# EAGLE board xio4_mez (EAGLE 9.4.2), part 1 of 2
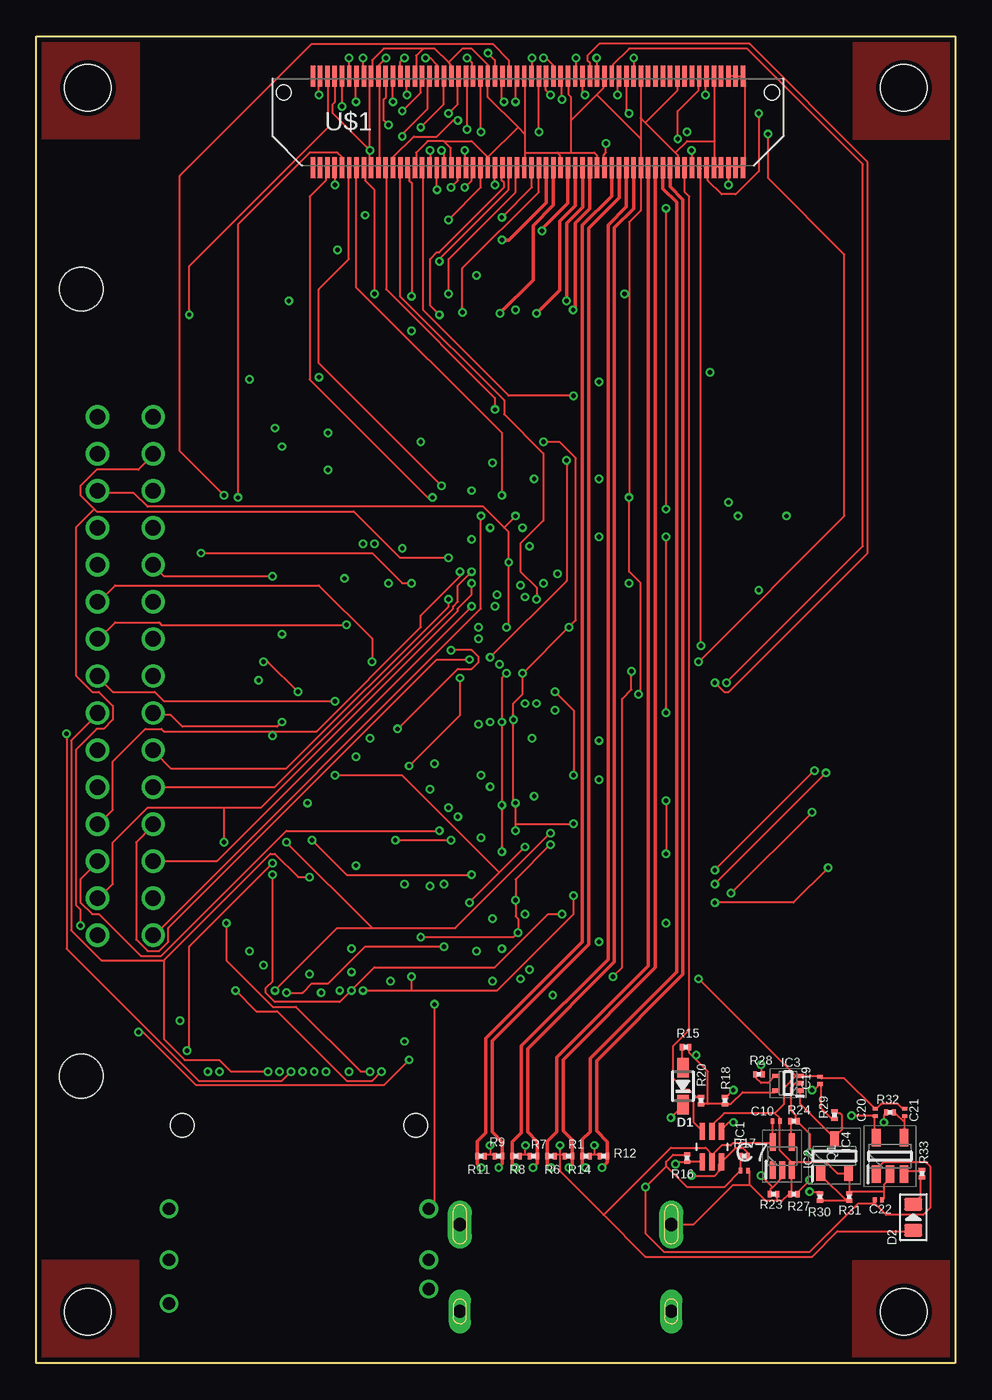
[diagram p7: board, top side]
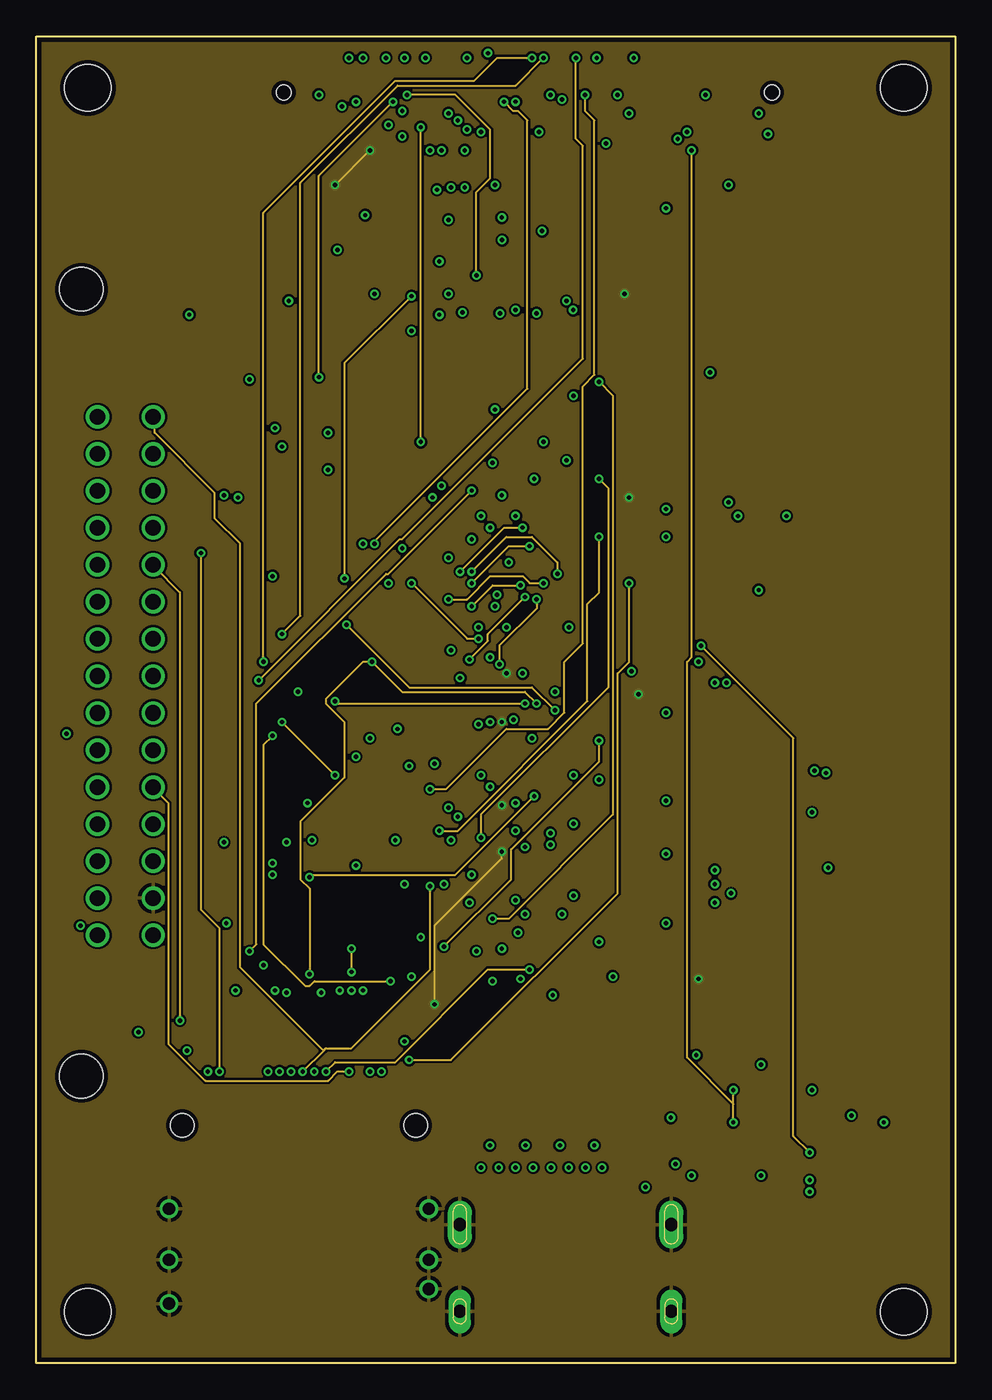
[diagram p8: board, inner layer Route2]
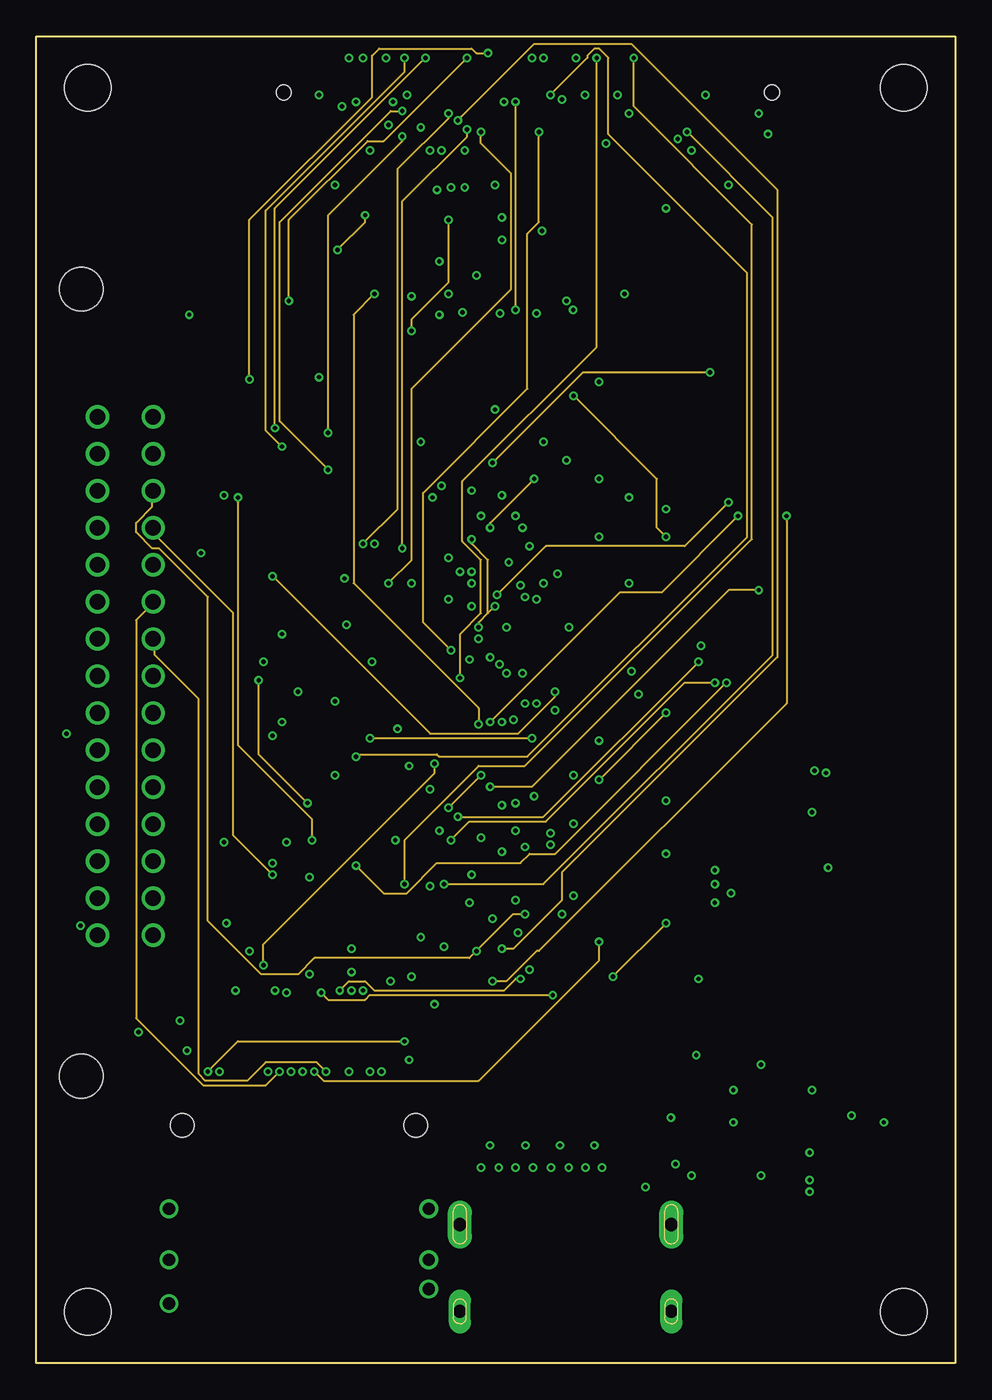
[diagram p9: board, inner layer Route15]
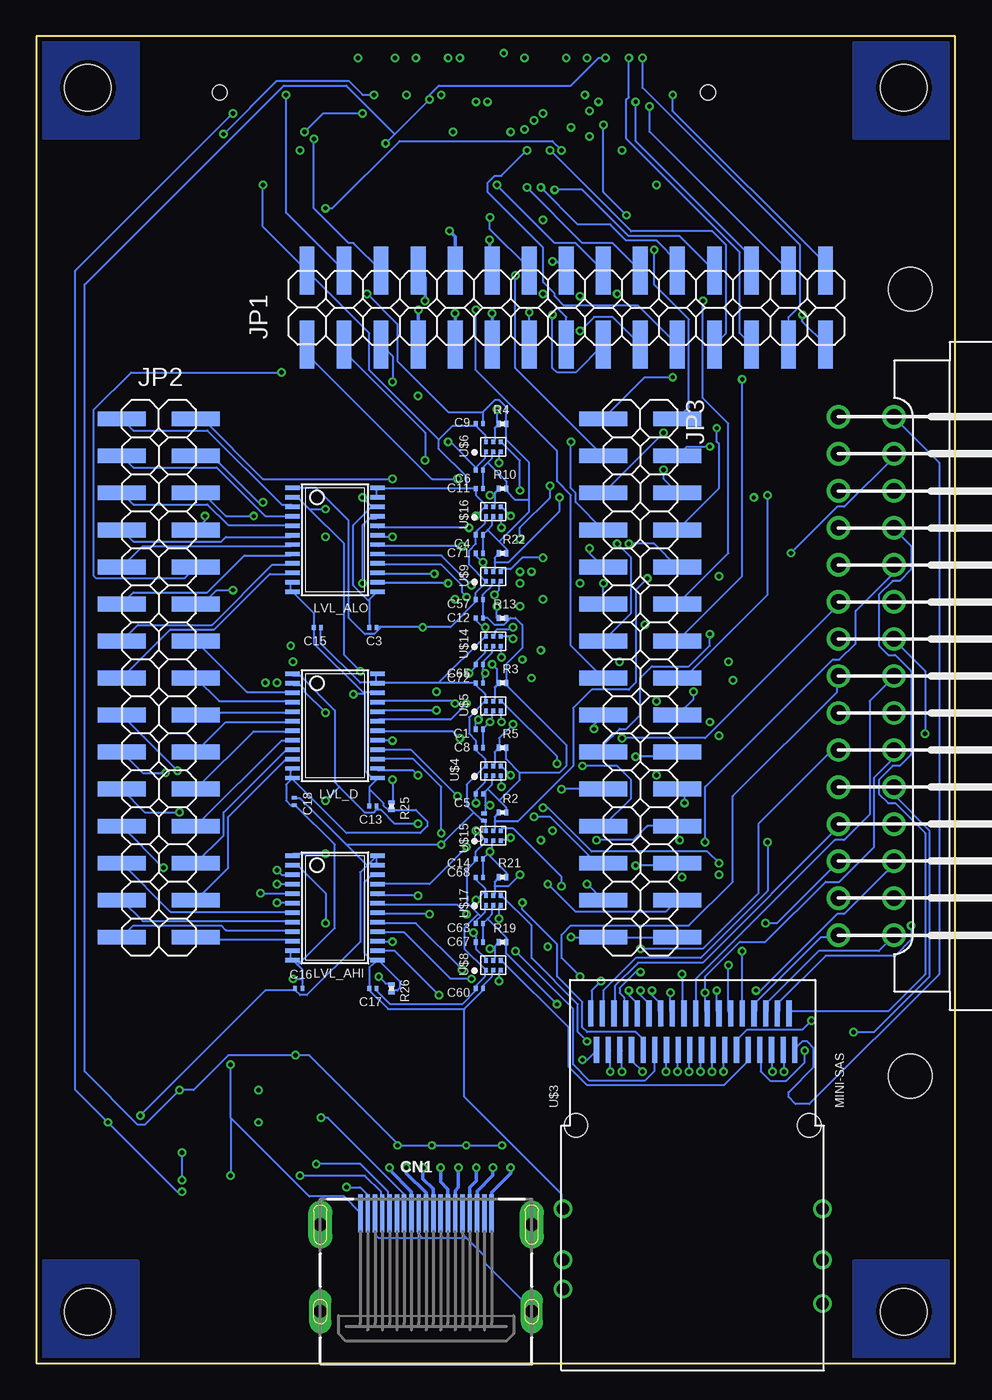
[diagram p10: board, bottom side, seen from below]

Size 63 x 91 mm. Coordinates in mm from the lower left corner, seen from the top.
Outline: 0,91 63,91 63,0 0,0 0,91
Copper layers (1+2*15+16): Top 0.035mm / dielectric 0.2mm / Route2 0.017mm / dielectric 1.2mm / Route15 0.017mm / dielectric 0.2mm / Bottom 0.035mm
Design rules "seed-4layer-6.6": minimum track width 6mil, minimum drill 0.3mm, track to track 6mil, track to pad 6mil, pad to pad 6mil, via to via 6mil, smd to smd 0mil, copper to edge 12mil, drill to drill 12mil, minimum pad ring 6mil, minimum via ring 5.5mil, stop-mask expansion 4mil, vias tented up to drill 25mil, thermal gap 10mil
Net classes: 1 Power: width 0.305 mm, drill 0.203 mm; 2 Slot-power: width 0.508 mm; 3 tx100: width 0.229 mm, clearance 0.203 mm; 4 usb90: width 0.254 mm, clearance 0.178 mm; 5 cclk50: width 0.203 mm; 6 3v3: width 0.254 mm; 7 vccint_aux: width 0.305 mm; 14 qspi: width 0.203 mm
Holes 3 mm at 3.08,19.68 3.08,73.66
Holes 3.2 mm at 3.52,3.52 3.52,87.48 59.48,87.48 59.48,3.52

## Footprints (pad centres in the part's own frame; a part is rotated, then mirrored left to right if it is on the bottom)
C0201 = smd 0.25 x 0.35: 1 -0.25,0; 2 0.25,0
A8_CART = drill 1.067: P1 -17.78,6.35; P2 -15.24,6.35; P3 -12.7,6.35; P4 -10.16,6.35; P5 -7.62,6.35; P6 -5.08,6.35; P7 -2.54,6.35; P8 0,6.35; P9 2.54,6.35; P10 5.08,6.35; P11 7.62,6.35; P12 10.16,6.35; P13 12.7,6.35; P14 15.24,6.35; P15 17.78,6.35; PA -17.78,10.16; PB -15.24,10.16; PC -12.7,10.16; PD -10.16,10.16; PE -7.62,10.16; PF -5.08,10.16; PH -2.54,10.16; PJ 0,10.16; PK 2.54,10.16; PL 5.08,10.16; PM 7.62,10.16; PN 10.16,10.16; PP 12.7,10.16; PR 15.24,10.16; PS 17.78,10.16
HDMI_MOLEX_47151-0001 = smd 0.3 x 2.6: 1 4.5,0; 2 4,0; 3 3.5,0; 4 3,0; 5 2.5,0; 6 2,0; 7 1.5,0; 8 1,0; 9 0.5,0; 10 0,0; 11 -0.5,0; 12 -1,0; 13 -1.5,0; 14 -2,0; 15 -2.5,0; 16 -3,0; 17 -3.5,0; 18 -4,0; 19 -4.5,0 | drill 0.9 pad 1.65 long: P$1 -7.25,-0.76; P$2 7.25,-0.76 | drill 0.9 pad 1.5 long: P$3 7.25,-6.72; P$4 -7.25,-6.72
SOD-323 = smd 1.35 x 0.8: A 1.27,0; C -1.27,0
LED-0805 = smd 0.889 x 1.27: + -0.889,0; - 0.889,0
SOT65P210X110X6N = smd 1.168 x 0.356: 1 -1.041,0.66; 2 -1.041,0; 3 -1.041,-0.66; 4 1.041,-0.66; 5 1.041,0; 6 1.041,0.66
SOT65P210X110-5N = smd 1.2 x 0.4: 1 -0.95,0.65; 2 -0.95,0; 3 -0.95,-0.65; 4 0.95,-0.65; 5 0.95,0.65
SOTFL50P160X60-5N = smd 0.475 x 0.3: 1 -0.838,0.5; 2 -0.838,0; 3 -0.838,-0.5; 4 0.838,-0.5; 5 0.838,0.5
SOT95P280X145-5N = smd 1.2 x 0.6: 1 -1.25,0.95; 2 -1.25,0; 3 -1.25,-0.95; 4 1.25,-0.95; 5 1.25,0.95
2X15SMD = smd 1.016 x 3.302: 1 -1.27,-3.81; 2 -1.27,1.27; 3 1.27,-3.81; 4 1.27,1.27; 5 3.81,-3.81; 6 3.81,1.27; 7 6.35,-3.81; 8 6.35,1.27; 9 8.89,-3.81; 10 8.89,1.27; 11 11.43,-3.81; 12 11.43,1.27; 13 13.97,-3.81; 14 13.97,1.27; 15 16.51,-3.81; 16 16.51,1.27; 17 19.05,-3.81; 18 19.05,1.27; 19 21.59,-3.81; 20 21.59,1.27; 21 24.13,-3.81; 22 24.13,1.27; 23 26.67,-3.81; 24 26.67,1.27; 25 29.21,-3.81; 26 29.21,1.27; 27 31.75,-3.81; 28 31.75,1.27; 29 34.29,-3.81; 30 34.29,1.27
TSSOP24 = smd 0.305 x 0.991: 1 -3.575,-2.918; 2 -2.925,-2.918; 3 -2.275,-2.918; 4 -1.625,-2.918; 5 -0.975,-2.918; 6 -0.325,-2.918; 7 0.325,-2.918; 8 0.975,-2.918; 9 1.625,-2.918; 10 2.275,-2.918; 11 2.925,-2.918; 12 3.575,-2.918; 13 3.575,2.918; 14 2.925,2.918; 15 2.275,2.918; 16 1.625,2.918; 17 0.975,2.918; 18 0.325,2.918; 19 -0.325,2.918; 20 -0.975,2.918; 21 -1.625,2.918; 22 -2.275,2.918; 23 -2.925,2.918; 24 -3.575,2.918
SOT96P237X111-3N = smd 1 x 0.6: 1 -1.2,0.955; 2 -1.2,-0.955; 3 1.2,0
R0201 = smd 0.28 x 0.43: 1 -0.255,0; 2 0.255,0
BTH-060-01-F-D-A = smd 0.305 x 1.448: 1 -14.75,3.136; 2 -14.75,-3.136; 3 -14.25,-3.136; 4 -14.25,3.136; 5 -13.75,-3.136; 6 -13.75,3.136; 7 -13.25,-3.136; 8 -13.25,3.136; 9 -12.75,-3.136; 10 -12.75,3.136; 11 -12.25,-3.136; 12 -12.25,3.136; 13 -11.75,-3.136; 14 -11.75,3.136; 15 -11.25,-3.136; 16 -11.25,3.136; 17 -10.75,-3.136; 18 -10.75,3.136; 19 -10.25,-3.136; 20 -10.25,3.136; 21 -9.75,-3.136; 22 -9.75,3.136; 23 -9.25,-3.136; 24 -9.25,3.136; 25 -8.75,-3.136; 26 -8.75,3.136; 27 -8.25,-3.136; 28 -8.25,3.136; 29 -7.75,-3.136; 30 -7.75,3.136; 31 -7.25,-3.136; 32 -7.25,3.136; 33 -6.75,-3.136; 34 -6.75,3.136; 35 -6.25,-3.136; 36 -6.25,3.136; 37 -5.75,-3.136; 38 -5.75,3.136; 39 -5.25,-3.136; 40 -5.25,3.136; 41 -4.75,-3.136; 42 -4.75,3.136; 43 -4.25,-3.136; 44 -4.25,3.136; 45 -3.75,-3.136; 46 -3.75,3.136; 47 -3.25,-3.136; 48 -3.25,3.136; 49 -2.75,-3.136; 50 -2.75,3.136; 51 -2.25,-3.136; 52 -2.25,3.136; 53 -1.75,-3.136; 54 -1.75,3.136; 55 -1.25,-3.136; 56 -1.25,3.136; 57 -0.75,-3.136; 58 -0.75,3.136; 59 -0.25,-3.136; 60 -0.25,3.136; 61 0.25,-3.136; 62 0.25,3.136; 63 0.75,-3.136; 64 0.75,3.136; 65 1.25,-3.136; 66 1.25,3.136; 67 1.75,-3.136; 68 1.75,3.136; 69 2.25,-3.136; 70 2.25,3.136; 71 2.75,-3.136; 72 2.75,3.136; 73 3.25,-3.136; 74 3.25,3.136; 75 3.75,-3.136; 76 3.75,3.136; 77 4.25,-3.136; 78 4.25,3.136; 79 4.75,-3.136; 80 4.75,3.136; 81 5.25,-3.136; 82 5.25,3.136; 83 5.75,-3.136; 84 5.75,3.136; 85 6.25,-3.136; 86 6.25,3.136; 87 6.75,-3.136; 88 6.75,3.136; 89 7.25,-3.136; 90 7.25,3.136; 91 7.75,-3.136; 92 7.75,3.136; 93 8.25,-3.136; 94 8.25,3.136; 95 8.75,-3.136; 96 8.75,3.136; 97 9.25,-3.136; 98 9.25,3.136; 99 9.75,-3.136; 100 9.75,3.136; 101 10.25,-3.136; 102 10.25,3.136; 103 10.75,-3.136; 104 10.75,3.136; 105 11.25,-3.136; 106 11.25,3.136; 107 11.75,-3.136; 108 11.75,3.136; 109 12.25,-3.136; 110 12.25,3.136; 111 12.75,-3.136; 112 12.75,3.136; 113 13.25,-3.136; 114 13.25,3.136; 115 13.75,-3.136; 116 13.75,3.136; 117 14.25,-3.136; 118 14.25,3.136; 119 14.75,-3.136; 120 14.75,3.136 | hole 1.016: -16.738,2.032; 16.738,2.032
MINI-SAS = smd 0.35 x 1.8: PA1 -6.2,8.78; PA2 -5.4,8.78; PA3 -4.6,8.78; PA4 -3.8,8.78; PA5 -3,8.78; PA6 -2.2,8.78; PA7 -1.4,8.78; PA8 -0.6,8.78; PA9 0.2,8.78; PA10 1,8.78; PA11 1.8,8.78; PA12 2.6,8.78; PA13 3.4,8.78; PA14 4.2,8.78; PA15 5,8.78; PA16 5.8,8.78; PA17 6.6,8.78; PA18 7.4,8.78; PB1 -6.6,11.29; PB2 -5.8,11.29; PB3 -5,11.29; PB4 -4.2,11.29; PB5 -3.4,11.29; PB6 -2.6,11.29; PB7 -1.8,11.29; PB8 -1,11.29; PB9 -0.2,11.29; PB10 0.6,11.29; PB11 1.4,11.29; PB12 2.2,11.29; PB13 3,11.29; PB14 3.8,11.29; PB15 4.6,11.29; PB16 5.4,11.29; PB17 6.2,11.29; PB18 7,11.29 | drill 0.85: SHIELD1 -8.5,-2.12; SHIELD2 -8.5,-5.62; SHIELD3 -8.5,-7.62; SHIELD4 9.3,-2.12; SHIELD5 9.3,-5.62; SHIELD6 9.3,-8.62 | hole 1.6: -7.6,3.6; 8.4,3.6
SOT886 = smd 0.325 x 0.27: 1 -0.338,0.5; 2 -0.338,0; 3 -0.338,-0.5; 4 0.338,-0.5; 5 0.338,0; 6 0.338,0.5

## Placement (x,y rotation side)
C1  0.1uF  [C0201]  32.63,43.48 0 bottom
C2  0.1uF  [C0201]  32.31,37.45 90 bottom
C3  0.1uF  [C0201]  39.93,50.45 180 bottom
C4  0.1uF  [C0201]  32.63,56.81 0 bottom
C5  0.1uF  [C0201]  32.63,39.03 0 bottom
C6  0.1uF  [C0201]  32.63,61.26 0 bottom
C7  0.1uF  [C0201]  48.53,13.2 0 top
C8  0.1uF  [C0201]  32.63,42.21 0 bottom
C9  0.1uF  [C0201]  32.63,64.44 0 bottom
C10  0.1uF  [C0201]  50.73,16.6 0 top
C11  0.1uF  [C0201]  32.63,59.99 0 bottom
C12  0.1uF  [C0201]  32.63,51.1 0 bottom
C13  0.1uF  [C0201]  39.93,38.21 180 bottom
C14  0.1uF  [C0201]  32.63,34.59 0 bottom
C15  0.1uF  [C0201]  43.74,50.45 180 bottom
C16  0.1uF  [C0201]  45.01,25.7 0 bottom
C17  0.1uF  [C0201]  39.93,25.7 180 bottom
C18  0.1uF  [C0201]  45.33,38.53 270 bottom
C19  0.1uF  [C0201]  53.73,19.4 90 top
C20  0.1uF  [C0201]  57.53,17.2 90 top
C21  0.1uF  [C0201]  59.53,17.2 90 top
C22  0.1uF  [C0201]  57.73,11.2 0 top
C57  0.1uF  [C0201]  32.63,52.37 0 bottom
C60  0.1uF  [C0201]  32.63,25.7 0 bottom
C63  0.1uF  [C0201]  32.63,30.14 0 bottom
C65  0.1uF  [C0201]  32.63,47.92 0 bottom
C67  0.1uF  [C0201]  32.63,28.88 0 bottom
C68  0.1uF  [C0201]  32.63,33.32 0 bottom
C71  0.1uF  [C0201]  32.63,55.55 0 bottom
C72  0.1uF  [C0201]  32.63,46.66 0 bottom
CARTRIDGE  5650118-1  [A8_CART]  -2.15,47.13 90 bottom
CN1  [HDMI_MOLEX_47151-0001]  36.28,10.26 0 bottom
D1  RB751V40,115  [SOD-323]  44.33,19 90 top
D2  RED-0805  [LED-0805]  60.13,10 90 top
IC1  SN74LVC2G07DCKR  [SOT65P210X110X6N]  46.32,14.84 270 top
IC2  SN74LVC1G07MDCKREP  [SOT65P210X110-5N]  51.13,14.2 90 top
IC3  NL17SZ126XV5T2G  [SOTFL50P160X60-5N]  51.53,19.2 180 top
IC4  TPS2051BDBVR  [SOT95P280X145-5N]  58.53,14.2 90 top
JP1  [2X15SMD]  43.18,73.66 0 bottom
JP2  [2X15SMD]  53.34,63.5 270 bottom
JP3  [2X15SMD]  20.32,63.5 270 bottom
LVL_AHI  SN74LVC8T245  [TSSOP24]  42.53,31.22 270 bottom
LVL_ALO  SN74LVC8T245  [TSSOP24]  42.53,56.47 270 bottom
LVL_D  SN74LVC8T245  [TSSOP24]  42.53,43.71 270 bottom
Q1  SMMBT3904LT1G  [SOT96P237X111-3N]  54.73,14.2 90 top
R1  49R9  [R0201]  36.48,14.2 0 top
R2  10K  [R0201]  31.04,37.77 0 bottom
R3  10K  [R0201]  31.04,46.66 0 bottom
R4  10K  [R0201]  31.04,64.44 0 bottom
R5  10K  [R0201]  31.04,42.21 0 bottom
R6  49R9  [R0201]  35.28,14.2 180 top
R7  49R9  [R0201]  34.09,14.2 0 top
R8  49R9  [R0201]  32.88,14.2 180 top
R9  49R9  [R0201]  31.68,14.2 0 top
R10  10K  [R0201]  31.04,59.99 0 bottom
R11  49R9  [R0201]  30.48,14.2 180 top
R12  49R9  [R0201]  38.88,14.2 0 top
R13  10K  [R0201]  31.04,51.1 0 bottom
R14  49R9  [R0201]  37.69,14.2 180 top
R15  27K  [R0201]  44.52,21.66 0 top
R16  1K5  [R0201]  44.62,14.07 90 top
R17  1K5  [R0201]  48.53,14.2 180 top
R18  4K7  [R0201]  47.22,18 90 top
R19  10K  [R0201]  31.04,28.88 0 bottom
R20  4K7  [R0201]  45.56,18 90 top
R21  10K  [R0201]  31.04,33.32 0 bottom
R22  10K  [R0201]  31.04,55.55 0 bottom
R23  100K  [R0201]  50.53,11.6 180 top
R24  1K  [R0201]  51.93,16.6 0 top
R25  10K  [R0201]  38.66,38.21 270 bottom
R26  10K  [R0201]  38.66,25.7 270 bottom
R27  100K  [R0201]  51.93,11.6 0 top
R28  1K  [R0201]  49.53,19.8 0 top
R29  10K  [R0201]  54.73,17 90 top
R30  1K  [R0201]  53.73,11.4 270 top
R31  10K  [R0201]  55.73,11.4 90 top
R32  10K  [R0201]  58.53,17.2 180 top
R33  820R  [R0201]  60.73,13 270 top
U$1  BTH-060-01-F-D-A  [BTH-060-01-F-D-A]  33.7,85.13 0 top
U$3  MINI-SAS  [MINI-SAS]  18.4,12.7 0 bottom
U$4  74LVC1T45GWSOT866  [SOT886]  31.68,40.62 90 bottom
U$5  74LVC1T45GWSOT866  [SOT886]  31.68,45.07 90 bottom
U$6  74LVC1T45GWSOT866  [SOT886]  31.68,62.85 90 bottom
U$8  74LVC1T45GWSOT866  [SOT886]  31.68,27.29 90 bottom
U$9  74LVC1T45GWSOT866  [SOT886]  31.68,53.96 90 bottom
U$14  74LVC1T45GWSOT866  [SOT886]  31.68,49.51 90 bottom
U$15  74LVC1T45GWSOT866  [SOT886]  31.68,36.18 90 bottom
U$16  74LVC1T45GWSOT866  [SOT886]  31.68,58.4 90 bottom
U$17  74LVC1T45GWSOT866  [SOT886]  31.68,31.73 90 bottom